# EAGLE design usdx_smd (EAGLE 7.7.0)

## Sheet 1 of 10: MAIN
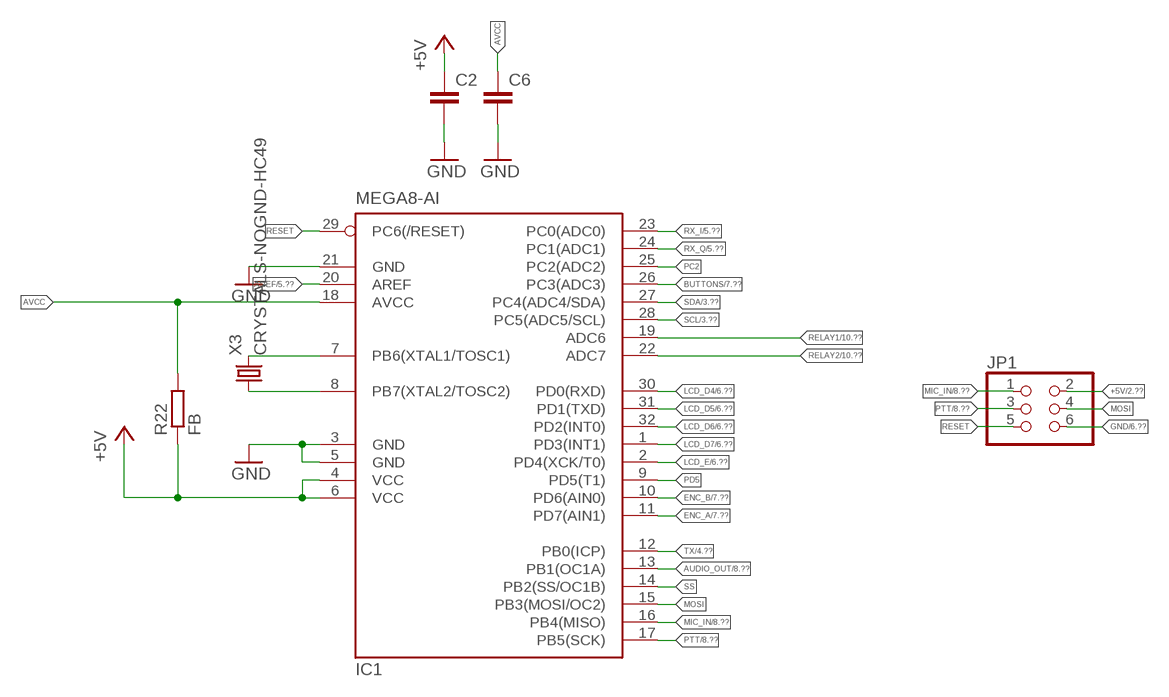
[diagram p0: schematic, sheet 1]

### Parts
C2  C-EUC0603K  [C0603K]
C6  C-EUC0603K  [C0603K]
IC1  MEGA8-AI  [TQFP32-08]
JP1  PINHD-2X3  [2X03]
R22  FB  R-EU_R1206  [R1206]
X3  CRYSTALS-NOGND-HC49  [HC49]

### Nets
+5V: C2.1 IC1.4(VCC) IC1.6(VCC) JP1.2 R22.1 ; also sheet 2,3,4,5,7,10
AREF: IC1.20(AREF) ; also sheet 5,8
AUDIO_OUT: IC1.13(PB1(OC1A)) ; also sheet 8
AVCC: C6.1 IC1.18(AVCC) R22.2
BUTTONS: IC1.26(PC3(ADC3)) ; also sheet 7
ENC_A: IC1.11(PD7(AIN1)) ; also sheet 7
ENC_B: IC1.10(PD6(AIN0)) ; also sheet 7
GND: C2.2 C6.2 IC1.3(GND) IC1.5(GND) IC1.21(GND) JP1.6 ; also sheet 2,3,4,5,6,7,8,10
LCD_D4: IC1.30(PD0(RXD)) ; also sheet 6
LCD_D5: IC1.31(PD1(TXD)) ; also sheet 6
LCD_D6: IC1.32(PD2(INT0)) ; also sheet 6
LCD_D7: IC1.1(PD3(INT1)) ; also sheet 6
LCD_E: IC1.2(PD4(XCK/T0)) ; also sheet 6
MIC_IN: IC1.16(PB4(MISO)) JP1.1 ; also sheet 8
MOSI: IC1.15(PB3(MOSI/OC2)) JP1.4
N$12: IC1.7(PB6(XTAL1/TOSC1)) X3.2
N$13: IC1.8(PB7(XTAL2/TOSC2)) X3.1
PC2: IC1.25(PC2(ADC2))
PD5: IC1.9(PD5(T1))
PTT: IC1.17(PB5(SCK)) JP1.3 ; also sheet 8
RELAY1: IC1.19(ADC6) ; also sheet 10
RELAY2: IC1.22(ADC7) ; also sheet 10
RESET: IC1.29(PC6(/RESET)) JP1.5
RX_I: IC1.23(PC0(ADC0)) ; also sheet 5
RX_Q: IC1.24(PC1(ADC1)) ; also sheet 5
SCL: IC1.28(PC5(ADC5/SCL)) ; also sheet 3
SDA: IC1.27(PC4(ADC4/SDA)) ; also sheet 3,6
SS: IC1.14(PB2(SS/OC1B))
TX: IC1.12(PB0(ICP)) ; also sheet 4

## Sheet 2 of 10: PSU
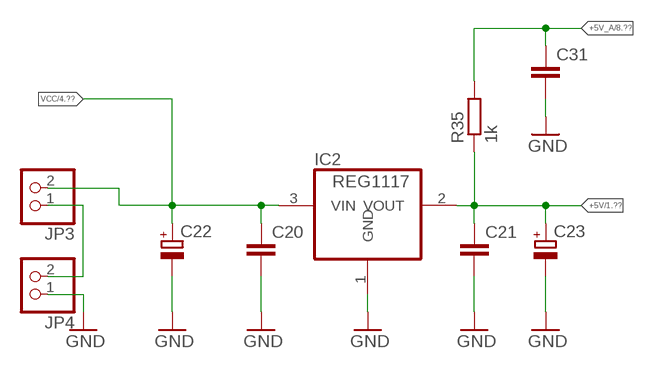
[diagram p1: schematic, sheet 2]

### Parts
C20  C-EUC0603K  [C0603K]
C21  C-EUC0603K  [C0603K]
C22  CPOL-EUE5-13  [E5-13]
C23  CPOL-EUCT7343  [CT7343]
C31  C-EUC0603K  [C0603K]
IC2  REG1117  [SOT223]
JP3  PINHD-1X2  [1X02]
JP4  PINHD-1X2  [1X02]
R35  1k  R-EU_M1206  [M1206]

### Nets
+5V: C21.1 C23.+ IC2.2(VOUT) R35.1 ; also sheet 1,3,4,5,7,10
+5V_A: C31.1 R35.2 ; also sheet 8
GND: C20.2 C21.2 C22.- C23.- C31.2 IC2.1(GND) JP4.1 ; also sheet 1,3,4,5,6,7,8,10
N$34: JP3.1 JP4.2
VCC: C20.1 C22.+ IC2.3(VIN) JP3.2 ; also sheet 4,6

## Sheet 3 of 10: PLL
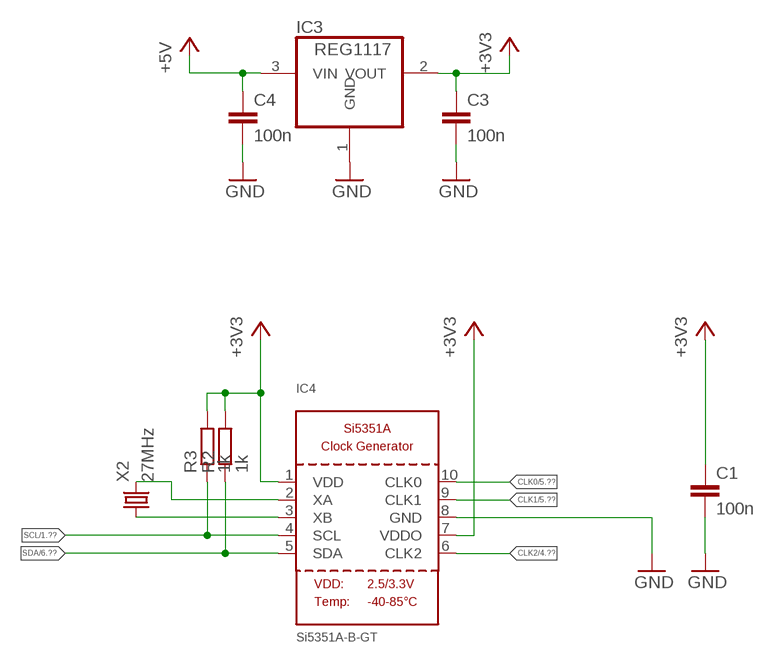
[diagram p2: schematic, sheet 3]

### Parts
C1  100n  C-EUC0603K  [C0603K]
C3  100n  C-EUC0603K  [C0603K]
C4  100n  C-EUC0603K  [C0603K]
IC3  REG1117  [SOT223]
IC4  Si5351A-B-GT  SI5351A  [MSOP10]
R2  1k  R-EU_M1206  [M1206]
R3  1k  R-EU_M1206  [M1206]
X2  27MHz  CRYSTALS-NOGND-HC49  [HC49]

### Nets
+3V3: C1.1 C3.1 IC3.2(VOUT) IC4.1(VDD) IC4.7(VDDO) R2.2 R3.2
+5V: C4.1 IC3.3(VIN) ; also sheet 1,2,4,5,7,10
CLK0: IC4.10(CLK0) ; also sheet 5
CLK1: IC4.9(CLK1) ; also sheet 5
CLK2: IC4.6(CLK2) ; also sheet 4
GND: C1.2 C3.2 C4.2 IC3.1(GND) IC4.8(GND) ; also sheet 1,2,4,5,6,7,8,10
N$4: IC4.3(XB) X2.1
N$5: IC4.2(XA) X2.2
SCL: IC4.4(SCL) R3.1 ; also sheet 1
SDA: IC4.5(SDA) R2.1 ; also sheet 1,6

## Sheet 4 of 10: TX
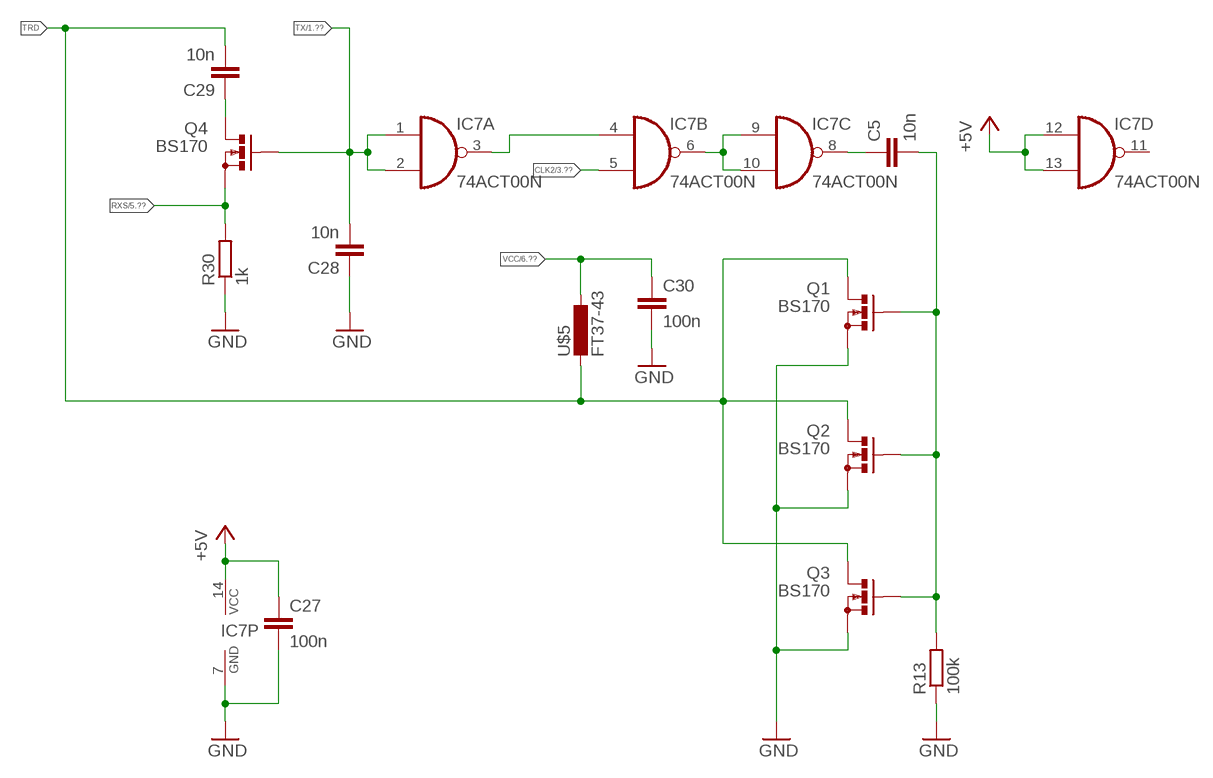
[diagram p3: schematic, sheet 4]

### Parts
C5  10n  C-EUC0603K  [C0603K]
C27  100n  C-EUC0603K  [C0603K]
C28  10n  C-EUC1206K  [C1206K]
C29  10n  C-EUC1206K  [C1206K]
C30  100n  C-EUC0603K  [C0603K]
IC7  74ACT00N  [DIL14]
Q1  BS170  [SOT54E]
Q2  BS170  [SOT54E]
Q3  BS170  [SOT54E]
Q4  BS170  [SOT54E]
R13  100k  R-EU_M1206  [M1206]
R30  1k  R-EU_R1206  [R1206]
U$5  FT37-43  T37  [T37]

### Nets
+5V: C27.1 IC7.12(D:I0) IC7.13(D:I1) IC7.14(P:VCC) ; also sheet 1,2,3,5,7,10
CLK2: IC7.5(B:I1) ; also sheet 3
GND: C27.2 C28.1 C30.2 IC7.7(P:GND) Q1.S Q2.S Q3.S R13.1 R30.1 ; also sheet 1,2,3,5,6,7,8,10
N$1: C5.2 Q1.G Q2.G Q3.G R13.2
N$2: C29.1 Q4.D
N$6: IC7.3(A:O) IC7.4(B:I0)
N$7: IC7.6(B:O) IC7.9(C:I0) IC7.10(C:I1)
N$9: C5.1 IC7.8(C:O)
RXS: Q4.S R30.2 ; also sheet 5
TRD: C29.2 Q1.D Q2.D Q3.D U$5.P$1
TX: C28.2 IC7.1(A:I0) IC7.2(A:I1) Q4.G ; also sheet 1
VCC: C30.1 U$5.P$2 ; also sheet 2,6
Unconnected: IC7.11(D:O)

## Sheet 5 of 10: RX
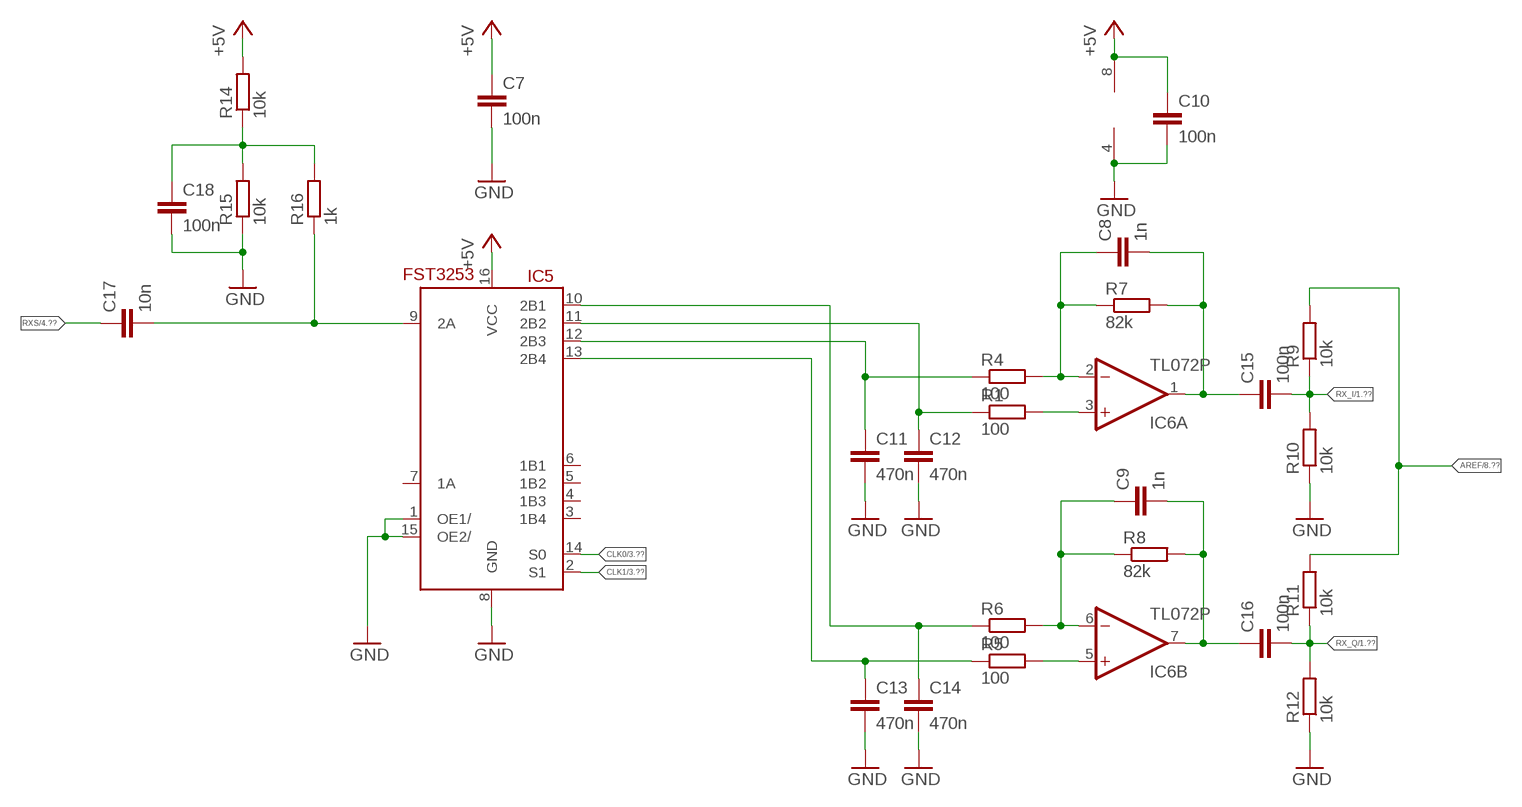
[diagram p4: schematic, sheet 5]

### Parts
C7  100n  C-EUC0603K  [C0603K]
C8  1n  C-EUC0603K  [C0603K]
C9  1n  C-EUC0603K  [C0603K]
C10  100n  C-EUC0603K  [C0603K]
C11  470n  C-EUC1206K  [C1206K]
C12  470n  C-EUC1206K  [C1206K]
C13  470n  C-EUC1206K  [C1206K]
C14  470n  C-EUC1206K  [C1206K]
C15  100n  C-EUC0603K  [C0603K]
C16  100n  C-EUC0603K  [C0603K]
C17  10n  C-EUC1206K  [C1206K]
C18  100n  C-EUC0603K  [C0603K]
IC5  FST3253  [TSSOP16]
IC6  TL072P  [DIL08]
R1  100  R-EU_M1206  [M1206]
R4  100  R-EU_M1206  [M1206]
R5  100  R-EU_M1206  [M1206]
R6  100  R-EU_M1206  [M1206]
R7  82k  R-EU_M1206  [M1206]
R8  82k  R-EU_M1206  [M1206]
R9  10k  R-EU_M1206  [M1206]
R10  10k  R-EU_M1206  [M1206]
R11  10k  R-EU_M1206  [M1206]
R12  10k  R-EU_M1206  [M1206]
R14  10k  R-EU_M1206  [M1206]
R15  10k  R-EU_M1206  [M1206]
R16  1k  R-EU_M1206  [M1206]

### Nets
+5V: C7.1 C10.1 IC5.16(VCC) IC6.8(P:V+) R14.2 ; also sheet 1,2,3,4,7,10
AREF: R9.2 R11.2 ; also sheet 1,8
CLK0: IC5.14(S0) ; also sheet 3
CLK1: IC5.2(S1) ; also sheet 3
GND: C7.2 C10.2 C11.2 C12.2 C13.2 C14.2 C18.2 IC5.1(OE1/) IC5.8(GND) IC5.15(OE2/) IC6.4(P:V-) R10.1 R12.1 R15.1 ; also sheet 1,2,3,4,6,7,8,10
N$3: IC6.3(A:+IN) R1.2
N$8: C8.1 IC6.2(A:-IN) R4.2 R7.1
N$10: IC6.5(B:+IN) R5.2
N$11: C9.1 IC6.6(B:-IN) R6.2 R8.1
N$14: C11.1 IC5.12(2B3) R4.1
N$15: C12.1 IC5.11(2B2) R1.1
N$16: C8.2 C15.1 IC6.1(A:OUT) R7.2
N$17: C13.1 IC5.13(2B4) R5.1
N$18: C9.2 C16.1 IC6.7(B:OUT) R8.2
N$19: C14.1 IC5.10(2B1) R6.1
N$23: C18.1 R14.1 R15.2 R16.2
N$25: C17.2 IC5.9(2A) R16.1
RX_I: C15.2 R9.1 R10.2 ; also sheet 1
RX_Q: C16.2 R11.1 R12.2 ; also sheet 1
RXS: C17.1 ; also sheet 4
Unconnected: IC5.3(1B4) IC5.4(1B3) IC5.5(1B2) IC5.6(1B1) IC5.7(1A)

## Sheet 6 of 10: LCD
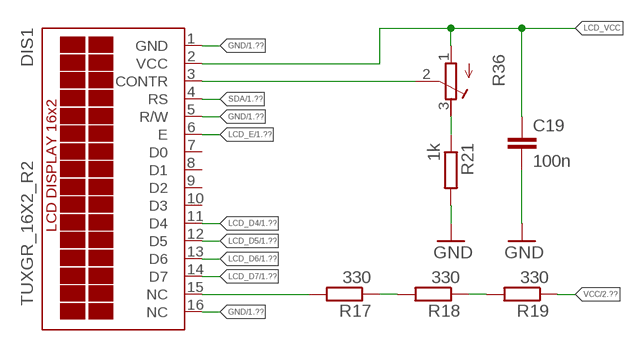
[diagram p5: schematic, sheet 6]

### Parts
C19  100n  C-EUC0603K  [C0603K]
DIS1  TUXGR_16X2_R2  [TUXGR_16X2_R2]
R17  330  R-EU_M1206  [M1206]
R18  330  R-EU_M1206  [M1206]
R19  330  R-EU_M1206  [M1206]
R21  1k  R-EU_M1206  [M1206]
R36  R-TRIMM3374  [RTRIM3374]

### Nets
GND: C19.2 DIS1.1(GND) DIS1.5(R/W) DIS1.16(NC) R21.2 ; also sheet 1,2,3,4,5,7,8,10
LCD_CONTR: DIS1.3(CONTR) R36.2(S)
LCD_D4: DIS1.11(D4) ; also sheet 1
LCD_D5: DIS1.12(D5) ; also sheet 1
LCD_D6: DIS1.13(D6) ; also sheet 1
LCD_D7: DIS1.14(D7) ; also sheet 1
LCD_E: DIS1.6(E) ; also sheet 1
LCD_VCC: C19.1 DIS1.2(VCC) R36.1(A)
N$21: R17.1 R18.2
N$24: DIS1.15(NC) R17.2
N$26: R18.1 R19.2
N$27: R21.1 R36.3(E)
SDA: DIS1.4(RS) ; also sheet 1,3
VCC: R19.1 ; also sheet 2,4
Unconnected: DIS1.7(D0) DIS1.8(D1) DIS1.9(D2) DIS1.10(D3)

## Sheet 7 of 10: KEYB
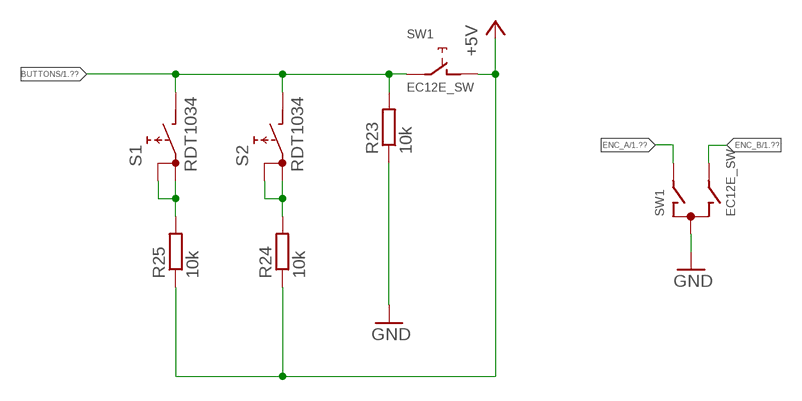
[diagram p6: schematic, sheet 7]

### Parts
R23  10k  R-EU_M1206  [M1206]
R24  10k  R-EU_M1206  [M1206]
R25  10k  R-EU_M1206  [M1206]
S1  RDT1034  [RDT1034]
S2  RDT1034  [RDT1034]
SW1  EC12E_SW  [ALPS_EC12E_SW]

### Nets
+5V: R24.1 R25.1 SW1.D ; also sheet 1,2,3,4,5,10
BUTTONS: R23.2 S1.B S2.B SW1.E ; also sheet 1
ENC_A: SW1.A ; also sheet 1
ENC_B: SW1.B ; also sheet 1
GND: R23.1 SW1.C ; also sheet 1,2,3,4,5,6,8,10
N$29: R24.2 S2.A S2.A1
N$30: R25.2 S1.A S1.A1
Unconnected: SW1.GND1(G) SW1.GND2(G)

## Sheet 8 of 10: JACKS
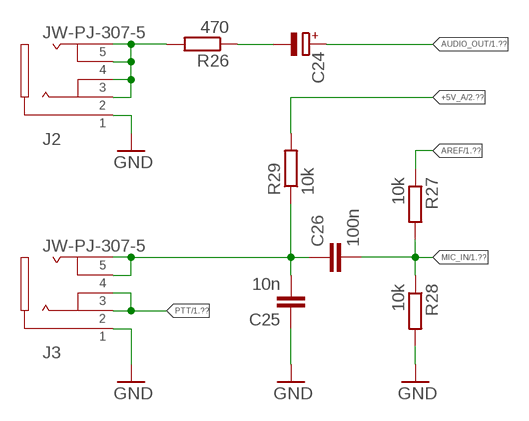
[diagram p7: schematic, sheet 8]

### Parts
C24  CPOL-EUCT7343  [CT7343]
C25  10n  C-EUC1206K  [C1206K]
C26  100n  C-EUC0603K  [C0603K]
J2  JW-PJ-307-5  [JW-PJ-307-X]
J3  JW-PJ-307-5  [JW-PJ-307-X]
R26  470  R-EU_M1206  [M1206]
R27  10k  R-EU_M1206  [M1206]
R28  10k  R-EU_M1206  [M1206]
R29  10k  R-EU_M1206  [M1206]

### Nets
+5V_A: R29.2 ; also sheet 2
AREF: R27.1 ; also sheet 1,5
AUDIO_OUT: C24.+ ; also sheet 1
GND: C25.1 J2.P$1 J3.P$1 R28.2 ; also sheet 1,2,3,4,5,6,7,10
MIC_IN: C26.2 R27.2 R28.1 ; also sheet 1
N$31: C24.- R26.1
N$32: C25.2 C26.1 J3.P$4 J3.P$5 R29.1
N$33: J2.P$2 J2.P$3 J2.P$4 J2.P$5 R26.2
PTT: J3.P$2 J3.P$3 ; also sheet 1

## Sheet 9 of 10: Screws
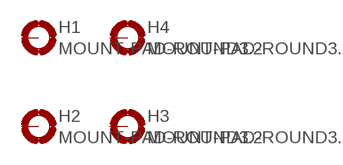
[diagram p8: schematic, sheet 9]

### Parts
H1  MOUNT-PAD-ROUND3.2  [3,2-PAD]
H2  MOUNT-PAD-ROUND3.2  [3,2-PAD]
H3  MOUNT-PAD-ROUND3.2  [3,2-PAD]
H4  MOUNT-PAD-ROUND3.2  [3,2-PAD]
Unconnected: H1.B3,2(MOUNT) H2.B3,2(MOUNT) H3.B3,2(MOUNT) H4.B3,2(MOUNT)

## Sheet 10 of 10: LPF
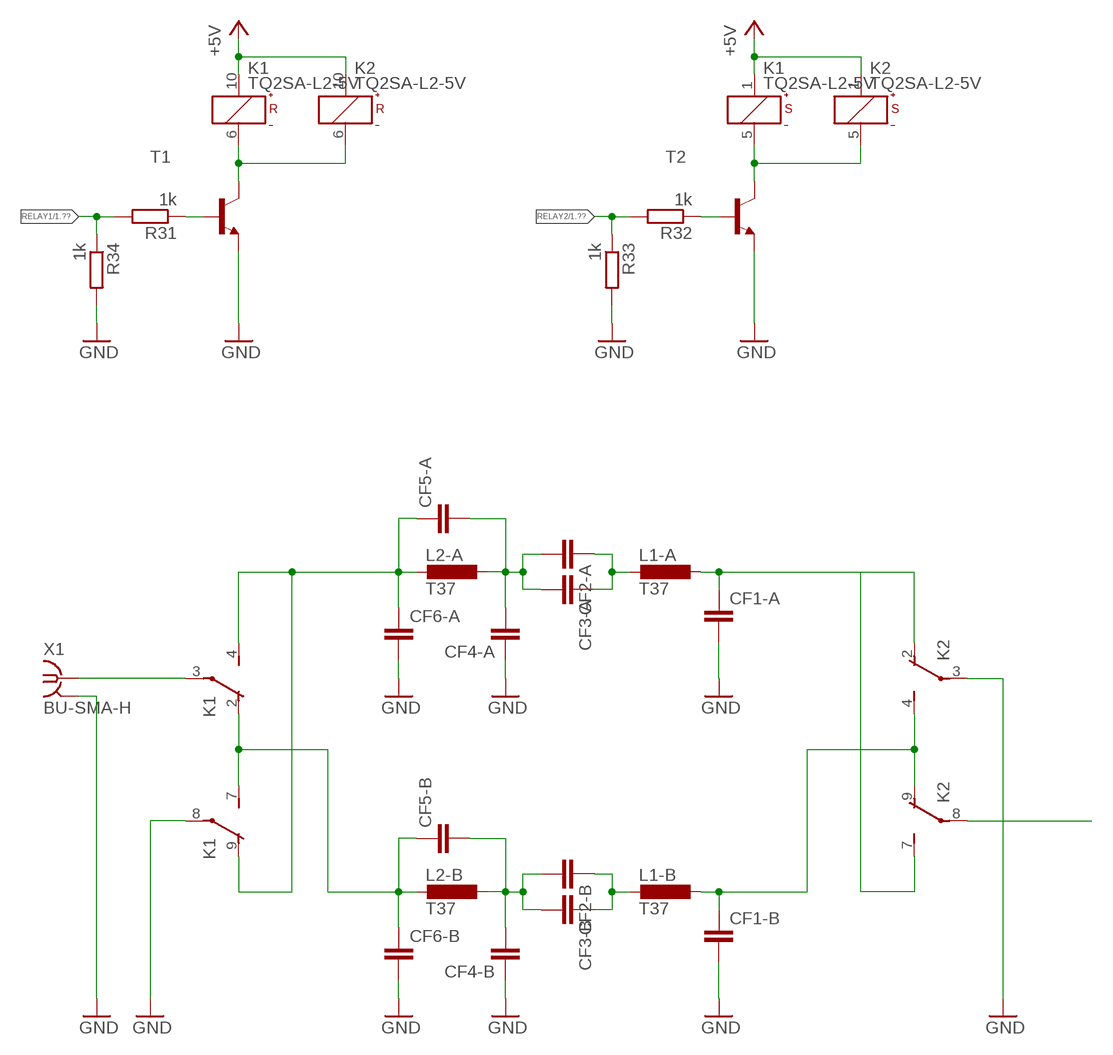
[diagram p9: schematic, sheet 10]

### Parts
CF1-A  C-EU025-024X044  [C025-024X044]
CF1-B  C-EU025-024X044  [C025-024X044]
CF2-A  C-EU025-024X044  [C025-024X044]
CF2-B  C-EU025-024X044  [C025-024X044]
CF3-A  C-EU025-024X044  [C025-024X044]
CF3-B  C-EU025-024X044  [C025-024X044]
CF4-A  C-EU025-024X044  [C025-024X044]
CF4-B  C-EU025-024X044  [C025-024X044]
CF5-A  C-EU025-024X044  [C025-024X044]
CF5-B  C-EU025-024X044  [C025-024X044]
CF6-A  C-EU025-024X044  [C025-024X044]
CF6-B  C-EU025-024X044  [C025-024X044]
K1  TQ2SA-L2-5V  [TQ-SA]
K2  TQ2SA-L2-5V  [TQ-SA]
L1-A  T37  [T37]
L1-B  T37  [T37]
L2-A  T37  [T37]
L2-B  T37  [T37]
R31  1k  R-EU_R1206  [R1206]
R32  1k  R-EU_R1206  [R1206]
R33  1k  R-EU_R1206  [R1206]
R34  1k  R-EU_R1206  [R1206]
T1  -NPN-SOT23-EBC  [SOT23-EBC]
T2  -NPN-SOT23-EBC  [SOT23-EBC]
X1  BU-SMA-H  [BU-SMA-H]

### Nets
+5V: K1.1(S:+) K1.10(R:+) K2.1(S:+) K2.10(R:+) ; also sheet 1,2,3,4,5,7
GND: CF1-A.2 CF1-B.2 CF4-A.1 CF4-B.1 CF6-A.2 CF6-B.2 K1.8(2:P) K2.3(1:P) R33.2 R34.2 T1.E T2.E X1.2 X1.3 X1.4 X1.5 ; also sheet 1,2,3,4,5,6,7,8
N$20: K1.6(R:-) K2.6(R:-) T1.C
N$22: K1.5(S:-) K2.5(S:-) T2.C
N$36: R31.1 T1.B
N$37: R32.1 T2.B
N$40: K1.3(1:P) X1.1
N$44: K2.8(2:P)
N$46: CF5-A.1 CF6-A.1 K1.4(1:S) K1.9(2:O) L2-A.P$1
N$47: CF2-A.2 CF3-A.2 CF4-A.2 CF5-A.2 L2-A.P$2
N$48: CF5-B.1 CF6-B.1 K1.2(1:O) K1.7(2:S) L2-B.P$1
N$49: CF2-B.2 CF3-B.2 CF4-B.2 CF5-B.2 L2-B.P$2
N$50: CF2-B.1 CF3-B.1 L1-B.P$1
N$51: CF2-A.1 CF3-A.1 L1-A.P$1
N$52: CF1-A.1 K2.2(1:O) K2.7(2:S) L1-A.P$2
N$53: CF1-B.1 K2.4(1:S) K2.9(2:O) L1-B.P$2
RELAY1: R31.2 R34.1 ; also sheet 1
RELAY2: R32.2 R33.1 ; also sheet 1

## Library data of the parts
C1-C21 C25-C31 CF1-A CF1-B CF2-A CF2-B CF3-A CF3-B CF4-A CF4-B CF5-A CF5-B CF6-A CF6-B = rcl:C-EU: CAPACITOR, European symbol
C22-C24 = rcl:CPOL-EU: POLARIZED CAPACITOR, European symbol
DIS1 = display-lcd:TUXGR_16X2_R2: Tuxgraphics LCD display 16x2 characters reflective, without background light Source: tuxgr_12x2_r2.pdf; OC_FARNELL: unknown; OC_NEWARK: unknown
H1-H4 = holes:MOUNT-PAD-ROUND: MOUNTING PAD, round
IC1 = atmel:MEGA8: MICROCONTROLLER 8 Kbytes FLASH, 1 kbytes SRAM, 512 bytes EEPROM, USART, 6-channel 10 bit ADC, 2-channel 8 bit ADC Pin compatible with Atmega48, ATMega88, ATMega168 Source: avr.lbr; MPN: ATMEGA8-16AU; OC_FARNELL: 9171371; OC_NEWARK: 73M8863
IC2 IC3 = burr-brown:REG1117: 800mA and 1A Low Dropout (LDO) Positive Regulator 1.8V, 2.5V, 2.85V, 3.3V, 5V, and Adj; MPN: REG1117; OC_FARNELL: 1097566; OC_NEWARK: 14P6981
IC4 = microbuilder:SI5351A: Si5351A 8kHz-160MHz I2C Clock Generator VDD: 2.5V or 3.3V Input Range: 25MHz or 27MHz XTAL User selectable internal input load capacitors: 6, 8 or 10 pF Output Impedance: 85 Ohm Output Load Capacitance: 5-15pF Operating Temperature: -40°C - 85°C Operating Current (3 outputs): 35mA Output buffer voltage (VDDO): 1.8, 2.5 or 3.3V Note: If VDDO is not used it should be connected to VDD. Unused clock out pins should be left floating.
IC5 = FST3253:FST3253
IC6 = linear:TL072: OP AMP
IC7 = 74xx-eu:74*00: Quad 2-input NAND gate
J2 J3 = audioconn:JW-PJ-307-5
JP1 = pinhead:PINHD-2X3: PIN HEADER
JP3 JP4 = pinhead:PINHD-1X2: PIN HEADER
K1 K2 = relay:TQ2?-L2-*: LOW PROFILE 2 FORM C RELAY NAiS 2 coil latching Source: http://www.mew-europe.com/.. en_ds_61020_0001.pdf Source: http://www.mew-europe.com/.. en_ds_61020_0002.pdf; MF: AROMAT/ MATSUSHITA; MPN: TQ2SA-L2-5V; OC_FARNELL: 625760; OC_NEWARK: 64K3202
L1-A L1-B L2-A L2-B U$5 = inductor:T37
Q1-Q4 = transistor-small-signal:BS170: N-CHANNEL MOS FET
R1-R19 R21-R35 = rcl:R-EU_: RESISTOR, European symbol
R36 = rcl:R-TRIMM: Trimm resistor
S1 S2 = switch:RDT1034: PUSH SWITCH www.radiohm.com
SW1 = switch-alps:EC12E_SW: ALPS rotary Encoder EC12E series with switch; MPN: EC12E2424407; OC_FARNELL: 1520813; OC_NEWARK: 74M1068
T1 T2 = transistor:*-NPN-: NPN Transistror BF959 corrected 2008.03.06
X1 = con-coax:BU-SMA-H: FEMALE SMA CONNECTOR Radiall; OC_FARNELL: unknown; OC_NEWARK: unknown
X2 X3 = IQD-Frequency-Products:CRYSTALS-NOGND: CRYSTALS CAN NOT GROUNDED

## Board
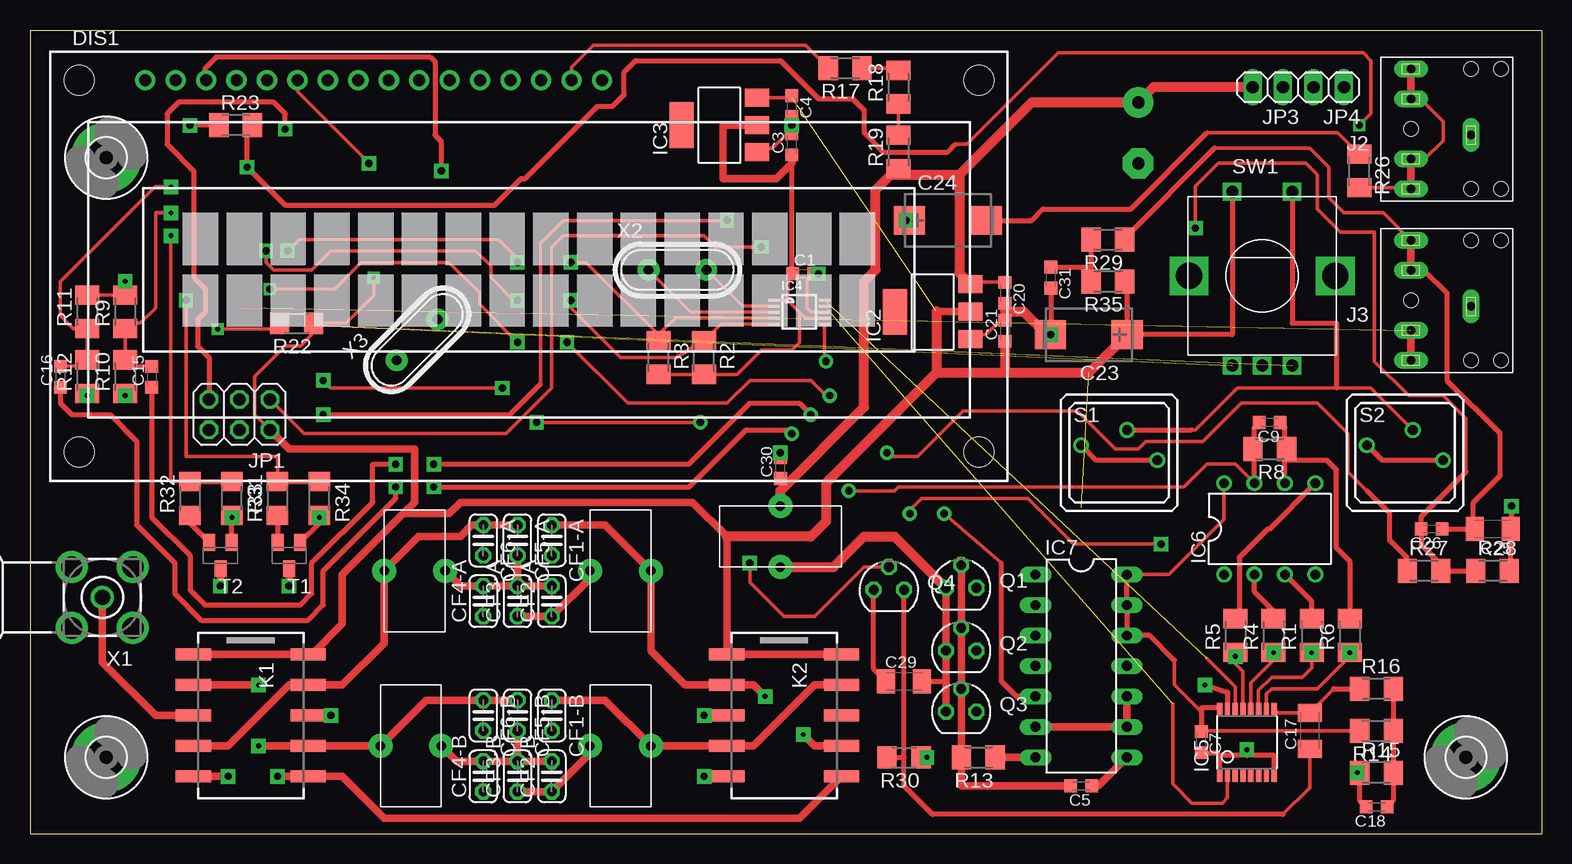
[diagram p10: board, top side]
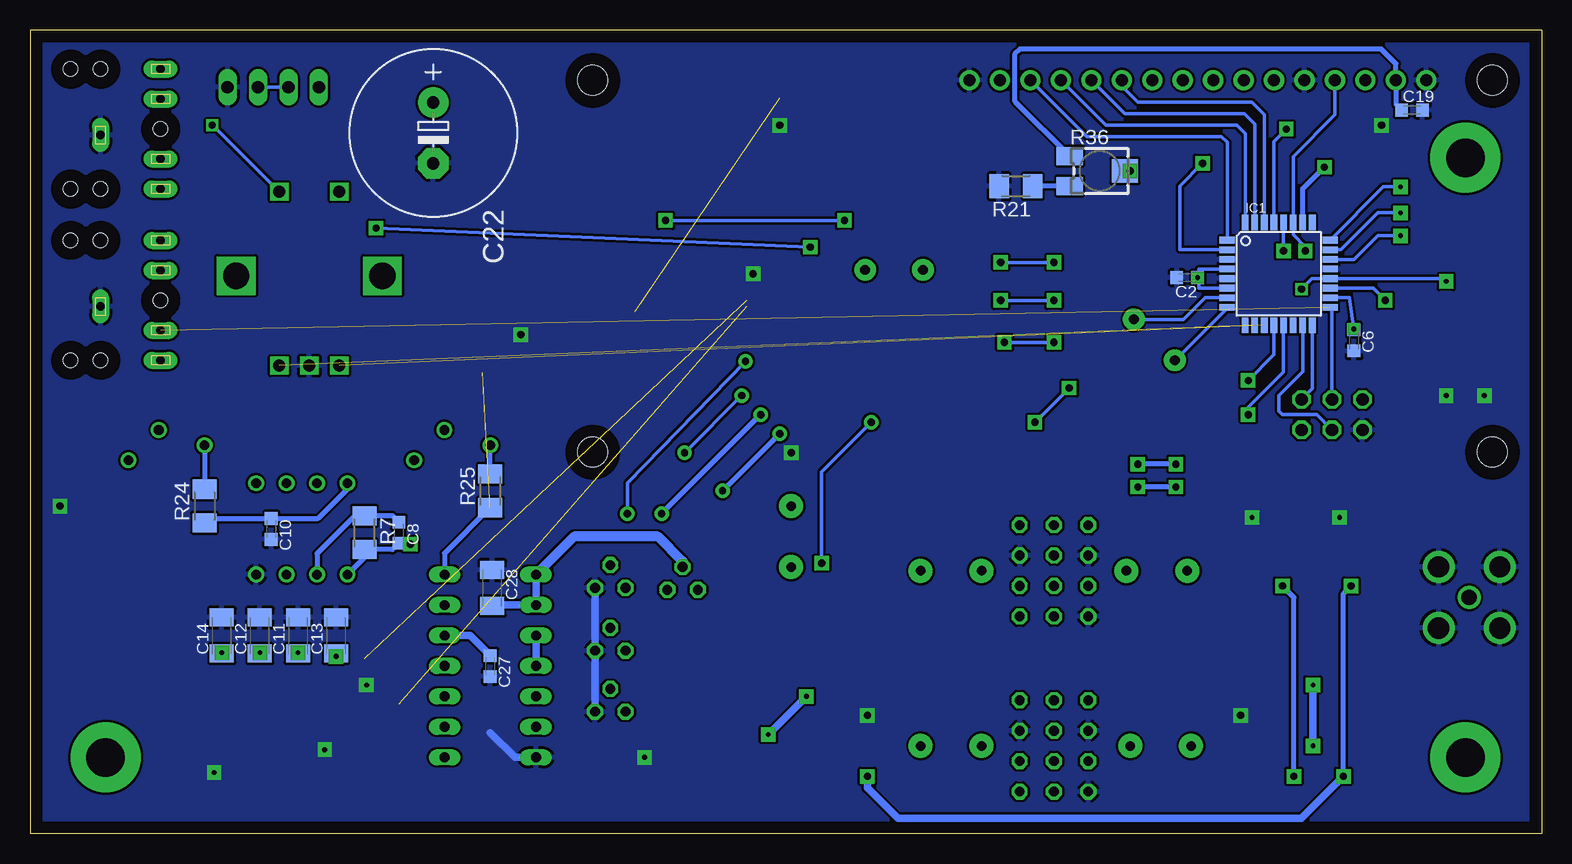
[diagram p11: board, bottom side, seen from below]

Size 126 x 67 mm. Coordinates in mm from the lower left corner, seen from the top.
Outline: 0,0 126,0 126,67 0,67 0,0
Copper layers (1*16): Top 0.035mm / dielectric 1.5mm / Bottom 0.035mm
Design rules "default": minimum track width 10mil, minimum drill 24mil, track to track 8mil, track to pad 8mil, pad to pad 8mil, via to via 8mil, smd to smd 8mil, copper to edge 40mil, drill to drill 8mil, minimum pad ring 10mil, minimum via ring 8mil, stop-mask expansion 4mil, vias tented up to drill 0mil, thermal gap 10mil

### Footprints (pad centres in the part's own frame; a part is rotated, then mirrored left to right if it is on the bottom)
C0603K = smd 1.05 x 1.08: 1 -0.875,0; 2 0.875,0
C1206K = smd 1.5 x 2: 1 -1.5,0; 2 1.5,0
E5-13 = drill 1.016 pad 2.54: + -2.54,0 | drill 1.016 pad 2.54 octagon: - 2.54,0
CT7343 = smd 2.6 x 2.4: + -3.2,0; - 3.2,0
C025-024X044 = drill 0.813 octagon: 1 -1.27,0; 2 1.27,0
TUXGR_16X2_R2 = drill 1 pad 1.676: 1 -32,15.5; 2 -29.46,15.5; 3 -26.92,15.5; 4 -24.38,15.5; 5 -21.84,15.5; 6 -19.3,15.5; 7 -16.76,15.5; 8 -14.22,15.5; 9 -11.68,15.5; 10 -9.14,15.5; 11 -6.6,15.5; 12 -4.06,15.5; 13 -1.52,15.5; 14 1.02,15.5; 15 3.56,15.5; 16 6.1,15.5 | hole 2.5: -37.5,-15.5; 37.5,-15.5; -37.5,15.5; 37.5,15.5
3,2-PAD = drill 3.2 pad 5.842: B3,2 0,0
TQFP32-08 = smd 1.27 x 0.559: 1 -4.293,2.8; 2 -4.293,2; 3 -4.293,1.2; 4 -4.293,0.4; 5 -4.293,-0.4; 6 -4.293,-1.2; 7 -4.293,-2; 8 -4.293,-2.8; 17 4.293,-2.8; 18 4.293,-2; 19 4.293,-1.2; 20 4.293,-0.4; 21 4.293,0.4; 22 4.293,1.2; 23 4.293,2; 24 4.293,2.8 | smd 0.559 x 1.27: 9 -2.8,-4.293; 10 -2,-4.293; 11 -1.2,-4.293; 12 -0.4,-4.293; 13 0.4,-4.293; 14 1.2,-4.293; 15 2,-4.293; 16 2.8,-4.293; 25 2.8,4.293; 26 2,4.293; 27 1.2,4.293; 28 0.4,4.293; 29 -0.4,4.293; 30 -1.2,4.293; 31 -2,4.293; 32 -2.8,4.293
SOT223 = smd 1.499 x 2.007: 1 -2.261,-3.15; 2 0.025,-3.15; 3 2.311,-3.15 | smd 3.81 x 2.007: 4 0,3.15
MSOP10 = smd 0.25 x 1: 1 -1,-2.113; 2 -0.5,-2.113; 3 0,-2.113; 4 0.5,-2.113; 5 1,-2.113; 6 1,2.113; 7 0.5,2.113; 8 0,2.113; 9 -0.5,2.113; 10 -1,2.113
TSSOP16 = smd 0.45 x 1.05: 1 -2.275,-2.768; 2 -1.625,-2.768; 3 -0.975,-2.768; 4 -0.325,-2.768; 5 0.325,-2.768; 6 0.975,-2.768; 7 1.625,-2.768; 8 2.275,-2.768; 9 2.275,2.768; 10 1.625,2.768; 11 0.975,2.768; 12 0.325,2.768; 13 -0.325,2.768; 14 -0.975,2.768; 15 -1.625,2.768; 16 -2.275,2.768
DIL08 = drill 0.813 pad 1.27: 1 -3.81,-3.81; 2 -1.27,-3.81; 3 1.27,-3.81; 4 3.81,-3.81; 5 3.81,3.81; 6 1.27,3.81; 7 -1.27,3.81; 8 -3.81,3.81
DIL14 = drill 0.813 long: 1 -7.62,-3.81; 2 -5.08,-3.81; 3 -2.54,-3.81; 4 0,-3.81; 5 2.54,-3.81; 6 5.08,-3.81; 7 7.62,-3.81; 8 7.62,3.81; 9 5.08,3.81; 10 2.54,3.81; 11 0,3.81; 12 -2.54,3.81; 13 -5.08,3.81; 14 -7.62,3.81
JW-PJ-307-X = drill 0.7 pad 1.422 long: P$1 -2,0.5; P$2 3,5; P$3 3,2.5; P$4 3,-2.5; P$5 3,-5 | hole 1.2: -4.5,5; -2,5; 3,0; -4.5,-5; -2,-5
2X03 = drill 1.016 octagon: 1 -2.54,-1.27; 2 -2.54,1.27; 3 0,-1.27; 4 0,1.27; 5 2.54,-1.27; 6 2.54,1.27
1X02 = drill 1.016 long: 1 -1.27,0; 2 1.27,0
TQ-SA = smd 1 x 2.94: 1 -5.08,-4.78; 2 -2.54,-4.78; 3 0,-4.78; 4 2.54,-4.78; 5 5.08,-4.78; 6 5.08,4.78; 7 2.54,4.78; 8 0,4.78; 9 -2.54,4.78; 10 -5.08,4.78
T37 = drill 0.8 pad 2: P$1 -2.54,0; P$2 2.54,0
SOT54E = drill 0.813 octagon: D -1.27,0; G 0,1.905; S 1.27,0
M1206 = smd 1.6 x 2: 1 -1.4,0; 2 1.4,0
R1206 = smd 1.6 x 1.803: 1 -1.422,0; 2 1.422,0
RTRIM3374 = smd 1.5 x 2.2: 1 -1.25,-2.5; 3 1.25,-2.5 | smd 1.98 x 2.17: 2 0,2.1
RDT1034 = drill 0.8: A 3.175,-0.635; A1 -3.175,0.635; B 0.65,1.9
ALPS_EC12E_SW = drill 1 square: A -2.5,-7.5; B 2.5,-7.5; C 0,-7.5; D -2.5,7; E 2.5,7 | drill 2.2 square: GND1 -6.1,0; GND2 6.1,0
SOT23-EBC = smd 1 x 1.4: B 0.95,-1.1; C 0,1.1; E -0.95,-1.1
BU-SMA-H = drill 1.27: 1 0,0 | drill 1.778: 2 -2.55,2.55; 3 2.55,2.55; 4 2.55,-2.55; 5 -2.55,-2.55
HC49 = drill 0.813 pad 1.8: 1 -2.413,0; 2 2.413,0

### Placement (x,y rotation side)
C1  64.45,46.67 0 top
C2  29.53,46.35 180 bottom
C3  63.5,57.47 90 top
C4  63.5,60.64 270 top
C5  87.63,3.97 180 top
C6  15.64,41.12 270 bottom
C7  97.63,7.62 270 top
C8  95.25,25.08 270 bottom
C9  103.35,34.29 180 top
C10  105.89,25.4 270 bottom
C11  103.66,16.51 90 bottom
C12  106.84,16.51 90 bottom
C13  100.49,16.51 90 bottom
C14  110.01,16.51 90 bottom
C15  10.16,38.1 90 top
C16  2.54,38.1 90 top
C17  106.68,8.57 90 top
C18  112.24,2.22 180 top
C19  10.79,60.33 0 bottom
C20  81.28,45.09 270 top
C21  81.28,41.91 90 top
C22  92.39,58.42 270 bottom
C23  88.27,41.59 180 top
C24  76.52,51.12 0 top
C25  121.92,25.4 180 top
C26  116.84,25.4 180 top
C27  87.63,13.97 270 bottom
C28  87.47,20.48 270 bottom
C29  72.87,12.7 0 top
C30  62.55,30.48 90 top
C31  85.09,46.35 270 top
CF1-A  43.5,24.45 270 top
CF1-B  43.5,9.84 270 top
CF2-A  43.5,19.37 90 top
CF2-B  43.5,4.76 90 top
CF3-A  40.64,19.37 90 top
CF3-B  40.64,4.76 90 top
CF4-A  37.78,19.37 90 top
CF4-B  37.78,4.76 90 top
CF5-A  40.64,24.45 270 top
CF5-B  40.64,9.84 270 top
CF6-A  37.78,24.45 270 top
CF6-B  37.78,9.84 270 top
DIS1  41.59,47.31 0 top
H1  6.35,6.35 0 top
H2  119.7,6.35 0 top
H3  6.35,56.35 0 top
H4  125.73,83.82 0 top  (outside the outline)
IC1  21.91,46.67 0 bottom
IC2  75.25,43.5 90 top
IC3  57.47,59.05 90 top
IC4  64.14,43.5 270 top
IC5  101.44,7.62 0 top
IC6  103.35,25.4 0 top
IC7  87.63,13.97 270 top
J2  118.11,58.74 180 top
J3  118.11,44.45 180 top
JP1  17.46,34.92 180 top
JP3  103.19,62.23 180 top
JP4  108.27,62.23 180 top
K1  18.41,9.84 270 top
K2  62.87,9.84 270 top
L1-A  49.21,21.91 0 top
L1-B  49.21,7.3 0 top
L2-A  32.07,21.91 0 top
L2-B  31.75,7.3 0 top
Q1  77.63,20.48 0 top
Q2  77.63,15.24 0 top
Q3  77.63,10.16 0 top
Q4  71.6,20.32 0 top
R1  106.84,16.51 90 top
R2  56.2,39.69 270 top
R3  52.39,39.69 270 top
R4  103.66,16.51 90 top
R5  100.49,16.51 90 top
R6  110.01,16.51 90 top
R7  98.11,25.08 270 bottom
R8  103.35,32.07 180 top
R9  7.94,43.5 90 top
R10  7.94,38.1 90 top
R11  4.76,43.5 90 top
R12  4.76,38.1 90 top
R13  79.06,6.35 180 top
R14  112.24,8.57 180 top
R15  112.24,5.08 0 top
R16  112.24,12.07 0 top
R17  67.94,63.82 180 top
R18  72.39,62.23 90 top
R19  72.39,56.83 90 top
R21  43.81,53.98 180 bottom
R22  22.23,42.55 180 top
R23  17.14,59.05 0 top
R24  111.44,27.3 90 bottom
R25  87.63,28.57 90 bottom
R26  110.81,55.24 270 top
R27  116.2,21.91 0 top
R28  121.92,21.91 0 top
R29  89.85,49.53 180 top
R30  72.87,6.35 180 top
R31  20.64,27.94 90 top
R32  13.34,27.94 90 top
R33  16.83,27.94 270 top
R34  24.13,27.94 270 top
R35  89.85,46.04 180 top
R36  36.83,55.24 270 bottom
S1  90.81,31.75 0 top
S2  114.62,31.75 0 top
SW1  102.71,46.51 0 top
T1  21.59,23.18 180 top
T2  15.88,23.18 180 top
U$5  62.55,24.77 90 top
X1  6.03,19.68 180 top
X2  53.98,46.99 0 top
X3  32.27,41.16 45 top

### Tracks (layer width: path | path; a pad name or v marks a point on that pad's centre or on a via)
+3V3
  Top 0.305: 63.42,56.59 C3.1 63.58,56.52 | 63.13,44.5 64.14,43.5 | 64.14,43.5 64.64,43 IC4.7 | 63.66,46.59 C1.1 63.5,46.67 63.18,46.35 63.18,44.55 63.13,44.5 | 63.13,44.5 IC4.1 | R3.2 R2.2 58.92,38.29 60.96,40.32 63.5,40.32 64.14,40.96 64.14,43.5
  Top 0.406: 63.5,46.67 63.5,55.56 63.34,55.72
  Top 0.61: IC3.2 57.78,59.08 57.78,54.61 62.23,54.61 63.34,55.72 63.5,55.88 C3.1
+5V  (via drill 0.4 pad 1)  (2 unrouted)
  Top 0.305: C4.1 63.5,61.37 IC3.3 | JP1.2 18.73,34.92 18.73,38.1 21.27,40.64 22.54,40.64 23.5,41.59 23.5,42.39 R22.1 26.35,42.55 28.66,44.85 v28.66,46.36 | IC6.8 99.54,26.19 94.93,21.59 IC7.14 | 95.41,14.45 95.41,12.38 97.63,10.16 | R14.2 97.71,8.57 C7.1
  Top 0.406: 91.12,41.59 C23.+ | C23.+ 91.47,45.83 R35.1 | SW1.D 100.21,41.59 C23.+ | 97.63,8.85 C7.1 97.63,10.16 97.63,10.48 99.08,10.48 IC5.16 | 95.41,14.45 93.34,16.51 IC7.12 IC7.13 IC7.14
  Top 0.61: 13.65,14.92 13.65,14.94 K1.1 K1.10 23.2,14.9 | 23.18,14.92 23.2,14.9 | K2.10 K2.1 58.1,14.94 58.1,24.77 55.24,27.62 35.88,27.62 34.92,26.67 31.11,26.67 | 23.2,14.9 23.48,14.9 26.04,17.46 26.04,21.59 31.11,26.67 | 31.11,26.67 32.07,27.62 32.07,32.07 21.59,32.07 JP1.2 | IC2.2 75.56,43.52
  Top 0.813: 75.56,43.52 75.56,38.42 | 75.56,38.42 81.28,38.42 | 81.28,38.42 88.29,38.42 C23.+ | C21.1 81.28,38.42 | 75.56,38.42 66.36,29.21 66.36,26.04 65.09,24.77 58.1,24.77
  Bottom 0.305: IC1.4 28.57,47.07 28.57,46.35 | 28.57,46.35 28.57,45.47 IC1.6 | 28.57,46.35 C2.1 v28.66,46.35 v28.66,46.36
  Bottom 0.406: R24.1 111.07,26.27 C10.1 102,26.27 99.54,28.73 IC6.8 | R25.1 91.44,23.36 IC7.14
  Bottom 0.61: IC7.12 89.3,16.51 C27.1
+5V_A
  Top 0.406: R29.2 88.45,47.31 | 88.45,47.31 R35.2 | C31.1 88.38,47.23 88.45,47.31
AREF  (via drill 0.4 pad 1.2, 0.6, 0.6 pad 1.2)
  Top 0.305: R11.2 R9.2 v7.94,46.04 | v20,45.4 25.4,45.4 27.62,47.62 34.92,47.62 37.47,45.09 37.47,44.13 v40.64,40.96 | v44.77,40.96 49.85,35.88 58.1,35.88 60.01,37.78 65.09,37.78 66.36,36.51 v66.67,36.51 | v71.44,31.75 71.75,31.43 73.98,31.43 77.79,35.24 87.31,35.24 90.49,32.07 92.39,32.07 93.03,32.7 97.79,32.7 100.97,35.88 107.31,35.88 109.86,33.34 109.86,30.16 111.44,28.57
  Top 0.406: R27.1 114.81,22.99 113.35,24.45 113.35,26.67 111.44,28.57
  Bottom 0.305: v7.94,46.04 8.17,46.27 IC1.20 19.13,46.27 v20,45.4 | v40.64,40.96 v44.77,40.96 | v66.67,36.51 v71.44,31.75
AUDIO_OUT  (via drill 0.6 pad 1.2)
  Top 0.305: v73.03,51.12 C24.+ | 42.55,37.47 42.55,49.21 44.45,51.12 v58.1,51.12
  Top 0.406: v24.45,34.92 40.01,34.92 42.55,37.47
  Bottom 0.305: v58.1,51.12 v73.03,51.12 | IC1.13 21.51,38.5 24.45,35.56 v24.45,34.92
AVCC  (via drill 0.4 pad 1)
  Top 0.305: v15.64,42.06 20.32,42.06 R22.2
  Bottom 0.305: IC1.18 16.03,44.67 v15.64,42.06
  Bottom 0.406: C6.1 v15.64,42.06
BUTTONS  (via drill 0.6, 0.6 pad 1.2)
  Top 0.305: S2.B 111.77,37.15 108.9,37.15 100.65,37.15 97.15,33.65 96.83,33.65 | v110.81,59.05 111.76,60.01 111.76,64.45 111.12,65.09 85.72,65.09 78.11,57.47 77.15,57.47
  Top 0.406: SW1.E 105.21,42.55 108.9,42.55 108.9,37.15 | S1.B 96.83,33.65 | R23.2 18.1,58.61 v18.1,55.56 21.27,52.39 38.73,52.39 40.96,54.61 41.27,54.61 47.31,60.64 48.58,60.64 49.53,61.59 49.53,63.5 50.48,64.45 62.55,64.45 65.72,61.28 68.58,61.28 69.53,60.33 69.53,58.42 71.12,56.83 76.52,56.83 77.15,57.47
  Bottom 0.305: SW1.E 110.75,59.05 v110.81,59.05
  Bottom 0.406: IC1.26 19.91,53.75 v18.1,55.56
CLK0  (1 unrouted)
  Top 0.305: IC5.14 100.47,12.25 98.11,14.61
CLK1  (1 unrouted)
  Top 0.305: IC5.2 99.82,2.98 99.38,2.54 96.84,2.54 95.25,4.13 95.25,10.79
CLK2  (via drill 0.6 pad 1.2)
  Top 0.305: IC4.6 66.25,39.48 v66.36,39.37 | v76.2,26.67 80.96,22.54
  Top 0.406: IC7.5 82.23,11.43 80.96,12.7 80.96,22.54
  Bottom 0.305: v66.36,39.37 76.2,29.21 v76.2,26.67
ENC_A  (1 unrouted)
ENC_B  (1 unrouted)
GND  (via drill 0.4 pad 1.2, 0.6 pad 1.2)
  Top 0.305: IC3.1 61.24,56.79 61.59,57.15 61.91,57.15 63.1,58.34 C3.2 v63.5,59.05 C4.2 | C1.2 64.77,46.12 64.77,43.81 65.09,43.5 IC4.8 | C20.2 81.28,43.5 C21.2 80.89,42.78 79.69,41.59 78.75,41.59 IC2.1
  Top 0.406: IC5.8 103.72,6.51 101.44,6.51 | 99.17,6.51 IC5.1 | 101.44,6.51 99.17,6.51 | T2.E v16.83,26.35 R33.2 | R34.2 v24.13,26.35 24.13,25.87 T1.E | 86.04,41.59 v85.09,41.59 | C31.2 85.09,41.62 | C18.2 110.84,2.75 R15.1 v110.65,5.08 | C7.2 98.93,6.75 99.17,6.51 | v97.95,12.38 99.82,11.79 IC5.15 | v101.44,6.99 101.44,6.51 | v74.77,6.35 R30.1 | v65.72,46.67 C1.2 | R28.2 123.42,22.01 C25.1 123.51,25.49 v123.51,27.3 | R23.1 v13.34,59.05 | C30.2 v62.55,31.75 | v7.94,36.51 R10.1 | v4.76,36.51 R12.1
  Top 0.61: R13.1 IC7.7 | K1.8 v25.08,9.84 | K2.3 v56.2,9.84 | C23.- v85.09,41.59
  Top 0.813: 81.28,43.5 82.87,43.5 84.77,41.59 C23.- 85.09,41.62
  Bottom 0.61: 87.63,8.41 85.57,6.35 IC7.7 | Q1.S Q2.S Q3.S
  pour Bottom: 0.16,67.02 0.16,0 126,0 126,67.02
LCD_CONTR  (via drill 0.6 pad 1.2)
  Top 0.406: DIS1.3 14.61,62.88 14.61,63.82 15.56,64.77 33.34,64.77 33.75,64.36 33.75,58.25 34.29,57.71 v34.29,55.24
  Bottom 0.406: v34.29,55.24 R36.2
LCD_D4
  Bottom 0.305: IC1.30 23.11,59.94 24.13,60.96 33.66,60.96 34.99,62.3 DIS1.11
LCD_D5
  Bottom 0.305: DIS1.12 34.73,60.01 24.77,60.01 23.91,59.15 IC1.31
LCD_D6
  Bottom 0.305: DIS1.13 36.32,59.05 25.4,59.05 24.71,58.36 IC1.32
LCD_D7
  Bottom 0.305: DIS1.14 37.91,58.1 26.67,58.1 26.2,57.63 IC1.1
LCD_E  (via drill 0.6 pad 1.2)
  Top 0.305: DIS1.6 22.29,61.84 v28.26,55.88
  Bottom 0.305: IC1.2 30.16,48.67 30.16,53.98 v28.26,55.88
LCD_VCC
  Bottom 0.305: 12.13,60.79 C19.1
  Bottom 0.406: 12.13,60.79 DIS1.2 12.13,64.2 13.34,65.41 43.5,65.41 43.88,65.02 43.88,61.03 39.37,56.52 39.37,56.49 R36.1
MIC_IN  (via drill 0.6 pad 1.2)
  Top 0.305: JP1.1 22.86,33.34 39.69,33.34 43.5,37.15 43.5,48.9 44.45,49.85 56.2,49.85 57.15,48.9 v60.96,48.9 | v97.16,50.48 97.16,53.98 99.06,55.88 106.36,55.88 107.31,54.93 107.31,52.07 109.22,50.16 112.08,50.16 112.08,39.37 114.94,36.51 117.79,36.51 119.7,34.61 119.7,30.16
  Top 0.406: R28.1 R27.2 117.47,22.04 117.47,22.54 115.97,24.05 C26.2 115.97,26.43 119.7,30.16
  Bottom 0.305: IC1.16 19.11,37.09 JP1.1 | v60.96,48.9 v97.16,50.48
MOSI
  Bottom 0.305: JP1.4 18.73,34.92 21.59,34.92 21.91,35.24 21.91,36.51 19.91,38.51 IC1.15
N$1
  Top 0.61: Q1.G Q2.G Q3.G 77.66,12.04 R13.2 77.66,3.97 C5.2
N$2
  Top 0.406: C29.1 70.33,13.74 Q4.D
N$3
  Top 0.406: R1.2 106.84,19.37 IC6.3
N$4
  Top 0.305: IC4.3 55.05,43.5 X2.1
N$5
  Top 0.305: IC4.2 59.38,44 X2.2
N$6
  Bottom 0.61: IC7.3 IC7.4
N$7
  Top 0.61: IC7.6 IC7.9 IC7.10
N$8
  Top 0.406: R4.2 103.66,18.57 102.08,20.16 IC6.2
  Bottom 0.406: C8.1 95.78,26.48 R7.1 98.93,26.48 102.08,23.34 IC6.2
N$9
  Top 0.61: IC7.8 89.06,3.97 C5.1
N$10
  Top 0.406: IC6.5 103.35,25.4 103.19,25.4 100.81,23.02 100.81,18.23 R5.2
N$11
  Top 0.406: IC6.6 104.62,31.11 | 104.62,31.11 104.62,32.07 | 104.62,32.07 104.62,33.9 C9.1 | R8.1 104.62,32.07 | 104.62,31.11 108.11,31.11 108.9,30.32 108.9,23.81 110.01,22.7 R6.2
N$12
  Bottom 0.305: IC1.7 28.04,44.67 29.84,42.86 X3.2
N$13
  Bottom 0.305: IC1.8 26.2,43.82 X3.1
N$14  (via drill 0.4 pad 1.2)
  Top 0.305: IC5.12 101.77,12.55 103.66,14.45 C11.1
  Top 0.406: 103.66,14.61 C11.1 v103.66,15.08 R4.1 | IC5.12
  Bottom 0.406: C11.1 v103.66,15.08
N$15  (via drill 0.4 pad 1.2)
  Top 0.305: IC5.11 102.42,11.93 103.5,13.02 106.05,13.02 106.84,13.81 v106.84,15.08
  Top 0.406: R1.1 v106.84,15.08
  Bottom 0.406: C12.1 v106.84,15.08
N$16  (via drill 0.6 pad 1.2)
  Top 0.305: v73.34,26.67 73.34,26.99 74.3,27.94 83.19,27.94 87,24.13 v94.3,24.13
  Top 0.406: C15.1 10.16,26.35 13.34,23.18 13.34,20.32 14.61,19.05 22.54,19.05 23.5,20 23.5,22.54 28.57,27.62 28.57,30.8 v30.48,30.8 | v33.66,30.8 54.93,30.8 60.01,35.88 64.14,35.88 v65.09,34.92
  Bottom 0.305: C8.2 95.17,24.13 v94.3,24.13
  Bottom 0.406: IC6.1 98.11,23.02 R7.2 95.78,23.68 C8.2 | v30.48,30.8 v33.66,30.8 | v65.09,34.92 v73.34,26.67
N$17  (via drill 0.4 pad 1.2)
  Top 0.305: IC5.13 101.12,13.5 100.49,14.13 v100.49,14.76
  Top 0.406: v100.49,14.76 R5.1
  Bottom 0.406: C13.1 v100.49,14.76
N$18  (via drill 0.6 pad 1.2)
  Top 0.305: IC6.7 100.49,30.8 98.11,30.8 96.2,28.89 72.39,28.89 72.07,28.57 v68.26,28.57
  Top 0.406: IC6.7 102.08,32.07 | 102.08,32.07 102.08,33.9 C9.2 | R8.2 102.08,32.07 | C16.1 2.54,35.88 3.49,34.92 6.67,34.92 8.89,32.7 8.89,25.72 12.06,22.54 12.06,20 14.29,17.78 23.18,17.78 24.45,19.05 24.45,21.91 30.48,27.94 v30.48,28.89 | v33.66,28.89 54.93,28.89 59.69,33.66 63.18,33.66 v63.5,33.34
  Bottom 0.406: v30.48,28.89 v33.66,28.89 | v63.5,33.34 v68.26,28.57
N$19  (via drill 0.4 pad 1.2)
  Top 0.305: IC5.10 103.07,11.63 103.5,12.06 107.31,12.06 109.86,14.61 109.86,14.92 v110.01,15.08 R6.1
  Bottom 0.305: C14.1 110.08,15.01 v110.01,15.08
N$20  (via drill 0.6 pad 1.2)
  Top 0.61: K2.6 64.15,1.27 29.53,1.27 26.04,4.76 K1.6 v20.64,4.76 | T1.C v21.59,20.64
  Bottom 0.406: v20.64,4.76 20.64,19.68 v21.59,20.64
N$21
  Top 0.305: R17.1 72.2,63.82 R18.2
N$22  (via drill 0.6 pad 1.2)
  Top 0.61: K1.5 v16.51,4.76 | T2.C v15.88,20.64 | K2.5 v56.2,4.76
  Bottom 0.406: v16.51,4.76 16.51,20 v15.88,20.64
  Bottom 0.61: v16.51,4.76 20,1.27 53.66,1.27 56.2,3.81 v56.2,4.76
N$23
  Top 0.406: R16.2 R14.1 | R14.1 R15.2 | R15.2 113.64,2.75 C18.1 | R15.2 | R14.1
N$24
  Top 0.305: DIS1.15 45.15,63.88 46.99,65.72 64.64,65.72 R17.2
N$25
  Top 0.305: IC5.9 104.03,10.07 C17.2 108.67,12.06
  Top 0.406: 108.67,12.06 R16.1 | R16.1
N$26
  Top 0.305: R19.2 R18.1
N$27
  Bottom 0.406: R36.3 39.35,53.98 R21.1
N$29
  Top 0.406: S2.A 112.71,31.11 S2.A1
  Bottom 0.406: S2.A1 R24.2
N$30
  Top 0.406: S1.A 88.9,31.11 S1.A1
  Bottom 0.406: R25.2 S1.A1
N$31
  Top 0.305: 98.11,58.42 109.03,58.42 R26.1
  Top 0.406: C24.- 83.5,51.12 84.45,52.07 91.76,52.07 98.11,58.42
N$32
  Top 0.305: 98.74,57.15 106.68,57.15 108.27,55.56 108.27,53.02 109.54,51.75 112.81,51.75 J3.P$5
  Top 0.406: J3.P$4 116.25,46.95 118.11,45.09 118.11,37.78 122.56,33.34 122.56,29.84 120.33,27.62 120.33,25.49 C25.2 C26.1 | R29.1 91.25,49.66 98.74,57.15
  Top 0.61: J3.P$5 J3.P$4
N$33
  Top 0.305: R26.2 115,53.84 J2.P$2 | J2.P$3 116.25,56.24 117.79,57.78 117.79,59.37 115.93,61.24 J2.P$4
  Top 0.61: J2.P$2 J2.P$3 | J2.P$4 J2.P$5
N$34
  Bottom 0.305: JP3.1 JP4.2
N$36
  Top 0.406: R31.1 20.64,25.87 T1.B
N$37
  Top 0.406: T2.B 13.34,25.87 R32.1
N$40
  Top 0.61: X1.1 6.03,14.29 10.48,9.84 K1.3
N$46
  Top 0.61: CF5-A.1 CF6-A.1 36.83,25.72 35.88,24.77 32.38,24.77 L2-A.P$1 29.53,15.88 26.04,12.38 K1.9 21.59,12.38 16.51,7.3 K1.4
N$47
  Top 0.61: CF3-A.2 CF4-A.2 35.88,20.64 L2-A.P$2 | CF3-A.2 CF2-A.2 | CF5-A.2 CF3-A.2
N$48  (via drill 0.4 pad 1.2)
  Top 0.61: CF5-B.1 CF6-B.1 33.02,11.11 L2-B.P$1 K1.7 v19.05,7.3 | K1.2 v19.05,12.38
  Bottom 0.61: v19.05,12.38 v19.05,7.3
N$49
  Top 0.61: L2-B.P$2 35.56,6.03 CF4-B.2 CF3-B.2 | CF3-B.2 CF2-B.2 | CF3-B.2 CF5-B.2
N$50
  Top 0.61: CF3-B.1 CF2-B.1 46.67,6.67 L1-B.P$1
N$51
  Top 0.61: CF3-A.1 CF2-A.1 46.67,21.27 L1-A.P$1
N$52  (via drill 0.4 pad 1.2)
  Top 0.61: CF1-A.1 47.94,25.72 L1-A.P$2 51.75,15.24 54.61,12.38 K2.2 60.33,12.38 v61.28,11.43 | K2.7 65.41,7.3 v64.45,8.26
  Bottom 0.61: v64.45,8.26 v61.28,11.43
N$53
  Top 0.61: CF1-B.1 47.94,11.11 L1-B.P$2 K2.4 60.33,7.3 65.41,12.38 K2.9
PTT  (1 unrouted)
  Top 0.61: J3.P$2 J3.P$3
  Bottom 0.305: JP1.3 17.46,43.72 arc-90 IC1.17
RELAY1  (via drill 0.6 pad 1.2)
  Top 0.305: v13.02,44.45 13.02,31.43 20.64,31.43 R31.2
  Top 0.406: R31.2 R34.1
  Bottom 0.305: IC1.19 14.04,45.47 v13.02,44.45
RELAY2  (via drill 0.4 pad 1.2)
  Top 0.305: 13.34,29.84 R32.2 11.75,29.36 v11.75,49.85
  Top 0.406: R32.2 R33.1
  Bottom 0.305: IC1.22 15.63,47.87 13.65,49.85 v11.75,49.85
RESET  (via drill 0.6 pad 1.2)
  Top 0.406: v21.27,58.74 21.27,60.01 20.32,60.96 12.38,60.96 11.43,60.01 11.43,57.47 13.65,55.24 13.65,46.35 14.61,45.4 14.61,43.5 13.97,42.86 13.97,40.64 14.92,39.69 JP1.5
  Bottom 0.305: IC1.29 22.31,57.7 v21.27,58.74
RX_I  (via drill 0.4 pad 1.2)
  Top 0.305: R10.2 R9.1 8.38,42.55 9.21,42.55 10.48,43.81 10.48,51.75 v11.75,51.75 | C15.2 7.73,38.98 R10.2 | 7.94,39.37 8.38,39.37 R10.2
  Bottom 0.305: IC1.23 16.73,48.67 13.65,51.75 v11.75,51.75
RX_Q  (via drill 0.4 pad 1.2)
  Top 0.305: R12.2 R11.1 3.62,42.1 2.54,43.18 2.54,46.04 10.42,53.92 v11.75,53.92 | C16.2 4.24,38.98 R12.2 | 4.76,39.37 4.89,39.37 R12.2
  Bottom 0.305: IC1.24 13.17,53.92 v11.75,53.92
RXS
  Top 0.305: 104.46,1.59 106.68,3.81 C17.1
  Top 0.406: 104.46,1.59 75.25,1.59 72.87,3.97 72.87,6.35 | 72.87,6.35 Q4.S | R30.2 72.87,6.35
SCL  (via drill 0.6 pad 1.2)
  Top 0.305: IC4.4 53.79,43 52.39,41.59 | 52.39,40.96 R3.1 52.39,41.59 | v45.09,47.62 46.35,47.62 52.39,41.59 | v21.51,48.58 22.46,49.53 39.05,49.53 40.64,47.94 v40.64,47.62
  Bottom 0.305: IC1.28 v21.51,48.58 | v40.64,47.62 v45.09,47.62
SDA  (via drill 0.6 pad 1.2)
  Top 0.305: IC4.5 57.61,42.5 R2.1 53.84,39.69 49.21,39.69 45.09,43.81 v45.09,44.45 | v19.68,48.58 19.68,47.62 20.32,46.99 23.5,46.99 25.08,48.58 37.15,48.58 38.42,47.31 38.42,46.35 40.32,44.45 v40.64,44.45
  Bottom 0.305: DIS1.4 17.21,59.94 20.71,56.45 IC1.27 20.71,49.92 19.68,48.9 v19.68,48.58 | v40.64,44.45 v45.09,44.45
TRD
  Top 0.406: C29.2 76.36,12.7
  Top 0.61: Q1.D Q2.D 76.36,12.7 Q3.D
  Top 0.813: U$5.P$1 66.99,22.23 69.53,24.77 72.07,24.77 Q1.D
TX  (via drill 0.6 pad 1.2)
  Top 0.305: v24.45,37.78 25.08,37.15 v39.37,37.15 | v42.23,34.29 v55.88,34.29 | v60.01,22.54 60.01,20.95 62.87,18.1 65.41,18.1 69.53,22.23 Q4.G
  Bottom 0.305: IC1.12 22.31,39.92 v24.45,37.78 | v39.37,37.15 v42.23,34.29 | v55.88,34.29 60.01,30.16 v60.01,22.54
  Bottom 0.61: IC7.1 IC7.2 87.47,19.05 C28.2
  Bottom 0.813: Q4.G 71.6,22.7 73.66,24.77 80.64,24.77 IC7.1
VCC
  Top 0.305: C20.1 78.55,45.96 IC2.3 78.4,46.06 | R19.1 72.39,54.93
  Top 0.406: C30.1 U$5.P$2
  Top 0.813: 77.47,54.93 83.5,60.96 C22.+ 93.66,62.23 JP3.2 | 77.47,54.93 77.47,46.74 IC2.3 | U$5.P$2 62.55,28.57 69.53,35.56 69.53,46.04 70.48,46.99 70.48,53.66 71.75,54.93 72.39,54.93 77.47,54.93